# Altium schematic sheet op-amp.SchDoc
size A4; SheetNumber: 6; SheetTotal: 7
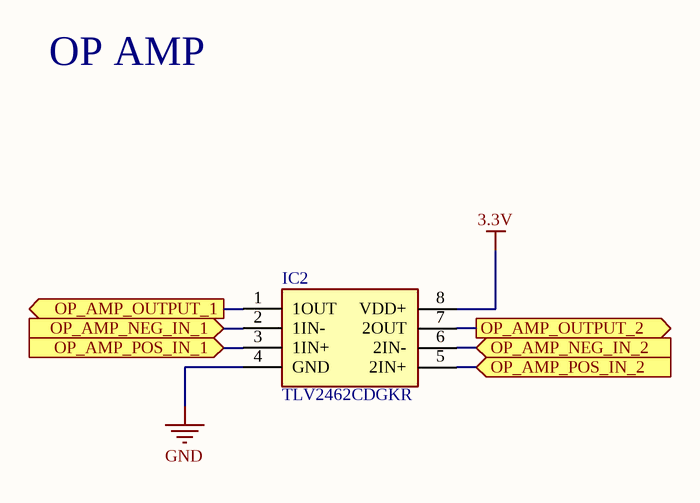
[diagram p0: op-amp.SchDoc]

## Parts
IC2  TLV2462CDGKR  [SOP65P490X110-8N]

## Ports
OP_AMP_NEG_IN_1 (in), OP_AMP_NEG_IN_2 (in), OP_AMP_OUTPUT_1 (out), OP_AMP_OUTPUT_2 (out), OP_AMP_POS_IN_1 (in), OP_AMP_POS_IN_2 (in)

## Nets
3.3V: IC2.8(VDD+)
GND: IC2.4(GND)
OP_AMP_NEG_IN_1: IC2.2(1IN-) ; port OP_AMP_NEG_IN_1
OP_AMP_NEG_IN_2: IC2.6(2IN-) ; port OP_AMP_NEG_IN_2
OP_AMP_OUTPUT_1: IC2.1(1OUT) ; port OP_AMP_OUTPUT_1
OP_AMP_OUTPUT_2: IC2.7(2OUT) ; port OP_AMP_OUTPUT_2
OP_AMP_POS_IN_1: IC2.3(1IN+) ; port OP_AMP_POS_IN_1
OP_AMP_POS_IN_2: IC2.5(2IN+) ; port OP_AMP_POS_IN_2

## Notes on the sheet
- OP AMP

## Library data of the parts
IC2 = TLV2462CDGKR: Integrated Circuit; Manufacturer_Name: Texas Instruments; Datasheet Link: http://www.ti.com/lit/gpn/TLV2462; Height: 1.1mm; Manufacturer_Part_Number: TLV2462CDGKR; Mouser Part Number: 595-TLV2462CDGKR; Mouser Price/Stock: https://www.mouser.co.uk/ProductDetail/Texas-Instruments/TLV2462CDGKR?qs=Fg5TsMy7H4uE1B0PPHeSQQ%3D%3D; Arrow Part Number: TLV2462CDGKR; Arrow Price/Stock: https://www.arrow.com/en/products/tlv2462cdgkr/texas-instruments?region=nac